# EAGLE design nodo_PS (EAGLE 9.6.2)
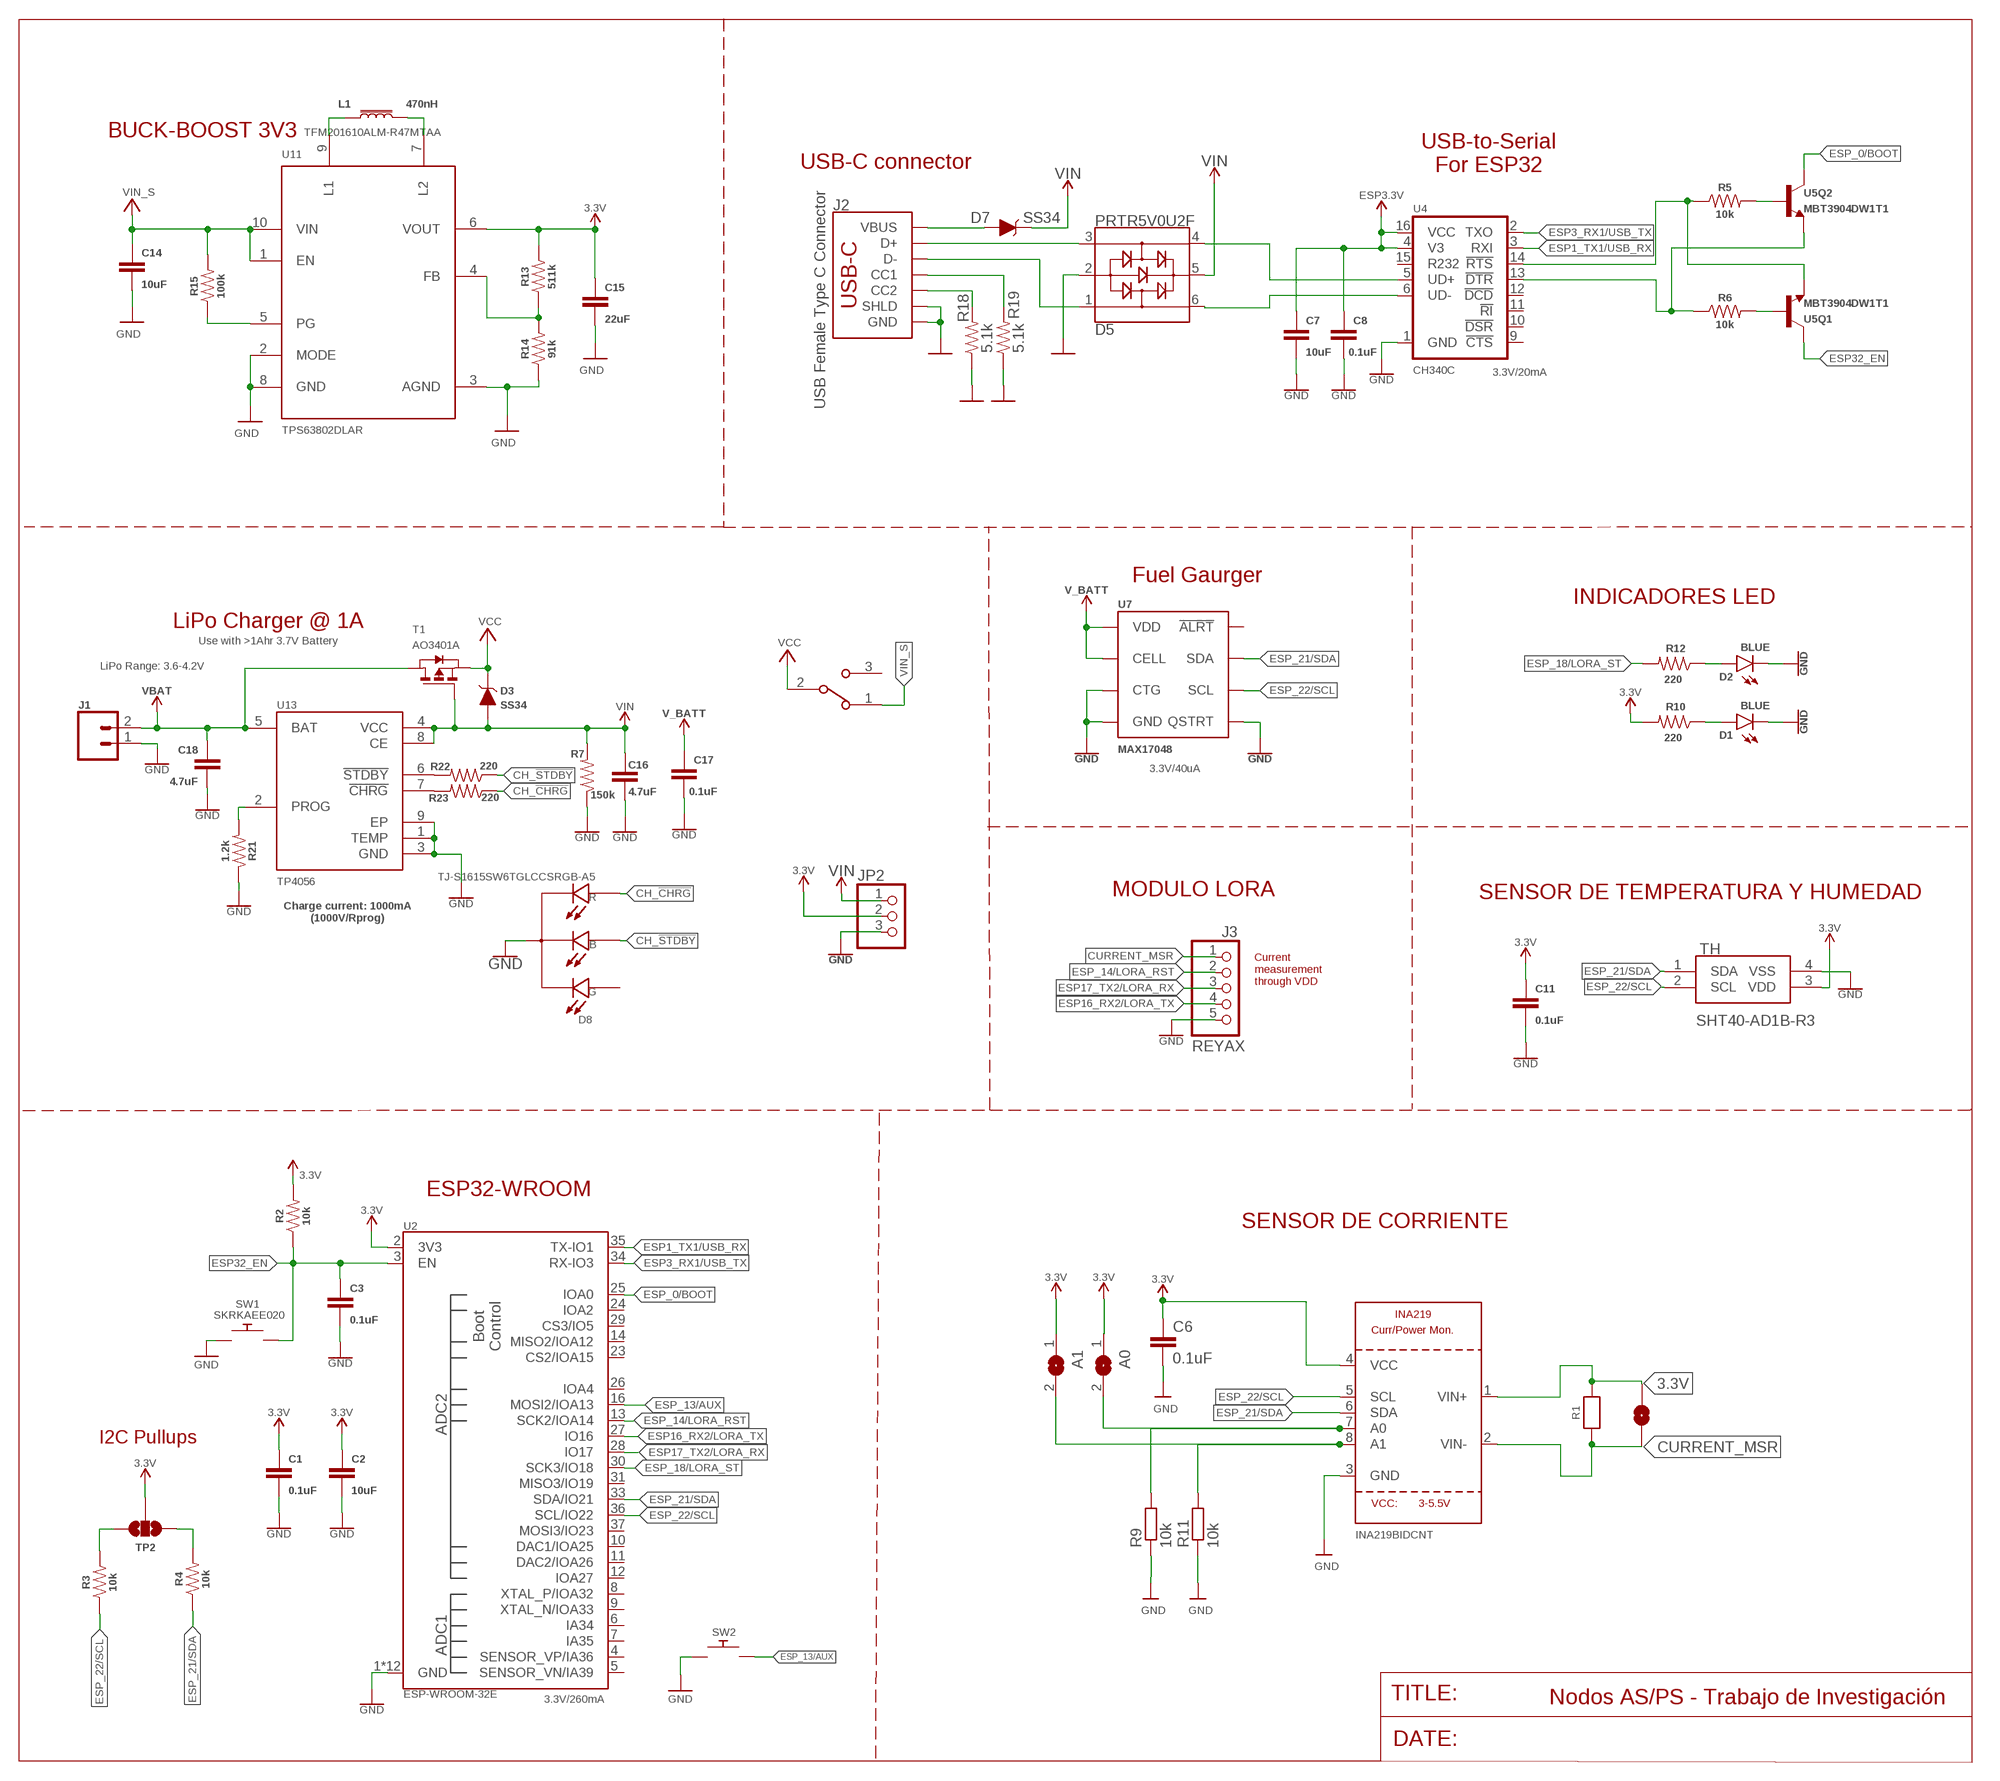
[diagram p0: schematic, sheet 1]

## Parts
A0  SOLDERJUMPERREFLOW_NOPASTE  [SOLDERJUMPER_REFLOW_NOPASTE]
A1  SOLDERJUMPERREFLOW_NOPASTE  [SOLDERJUMPER_REFLOW_NOPASTE]
C1  0.1uF  0.1UF-0603-25V-(+80/-20%)  [0603]
C2  10uF  10UF-0603-6.3V-20%  [0603]
C3  0.1uF  0.1UF-0603-25V-(+80/-20%)  [0603]
C6  0.1uF  C-EUC0805  [C0805]
C7  10uF  10UF-0603-6.3V-20%  [0603]
C8  0.1uF  0.1UF-0603-25V-(+80/-20%)  [0603]
C11  0.1uF  0.1UF-0603-25V-(+80/-20%)  [0603]
C14  10uF  22UF-1206-50V-10%  [1206]
C15  22uF  22UF-1206-50V-10%  [1206]
C16  4.7uF  4.7UF-0603-35V-(20%)  [0603]
C17  0.1uF  0.1UF-0603-25V-(+80/-20%)  [0603]
C18  4.7uF  4.7UF-0603-35V-(20%)  [0603]
D1  BLUE  LED-YELLOW0603  [LED-0603]
D2  BLUE  LED-YELLOW0603  [LED-0603]
D3  SS34  DIODE_TVS_UNI  [DO-214AC]
D5  PRTR5V0U2F  [SOT886]
D7  SS34  DIODE_TVS_UNI  [DO-214AC]
D8  TJ-S1615SW6TGLCCSRGB-A5  OSTB0603C1C  [LED_OSTB0603C1C]
J1  CONN_02LOCK_LONGPADS  [1X02_LOCK_LONGPADS]
J2  USB Female Type C Connector  USB_C_4-LAYER_PADS  [USB-C-16P_4LAYER-PADS]
J3  REYAX  PINHD-1X5  [1X05]
JP1  JUMPER-SMT_2_NO_NO-SILK_ROUND  [SMT-JUMPER_2_NO_NO-SILK_ROUND]
JP2  PINHD-1X3  [1X03]
L1  470nH  FERRITE_BEAD-0805-600Ω-100MHZ  [0805]
R1  0.1/1% (PT2512FK-070R1L)  RESISTOR2512  [2512]
R2  10k  10KOHM-0603-1/10W-1%  [0603]
R3  10k  10KOHM-0603-1/10W-1%  [0603]
R4  10k  10KOHM-0603-1/10W-1%  [0603]
R5  10k  10KOHM-0603-1/10W-1%  [0603]
R6  10k  10KOHM-0603-1/10W-1%  [0603]
R7  150k  150KOHM-0603-1/10W-1%  [0603]
R9  10k  R-EU_R0805  [R0805]
R10  220  20OHM-0603-1/10W-1%  [0603]
R11  10k  R-EU_R0805  [R0805]
R12  220  20OHM-0603-1/10W-1%  [0603]
R13  511k  750KOHM-0603-1/10W-1%  [0603]
R14  91k  750KOHM-0603-1/10W-1%  [0603]
R15  100k  750KOHM-0603-1/10W-1%  [0603]
R18  5.1k  5.1KOHM5.1KOHM-0603-1/10W-1%  [0603]
R19  5.1k  5.1KOHM5.1KOHM-0603-1/10W-1%  [0603]
R21  1.2k  150KOHM-0603-1/10W-1%  [0603]
R22  220  20OHM-0603-1/10W-1%  [0603]
R23  220  20OHM-0603-1/10W-1%  [0603]
S1  EG1213  [SW_EG1213]
SENSORCORRIENTE  INA219BIDCNT  INA219  [SOT23-8]
SW1  SKRKAEE020  [SKRKAEE020]
SW2  SKRKAEE020  [SKRKAEE020]
T1  AO3401A  PMOSSOT23  [SOT-23]
TH  SHT40-AD1B-R3  [SHT40AD1BR3]
TP2  JUMPER-SMT_3_NO_NO-SILK  [SMT-JUMPER_3_NO_NO-SILK]
U2  ESP-WROOM-32E  ESP-WROOM-3232D-NARROW  [ESP-WROOM-32D-NARROW]
U4  CH340C  [SO016]
U5  MBT3904DW1T1  TRANS_NPN_DUAL-MBT3904DW1T1  [SC70-6]
U7  MAX17048  MAX17048DFN8  [DFN-8]
U11  TPS63802DLAR  [VREG_TPS63802DLAR]
U13  TP4056  [SOP127P600X175-9N]

## Nets
3.3V [power]: A0.1 A1.1 C1.1 C2.1 C6.1 C7.1 C8.1 C11.1 C15.1 JP1.1 JP2.2 R1.2 R2.2 R10.2 R13.2 SENSORCORRIENTE.1(VIN+) SENSORCORRIENTE.4(VCC) TH.3(VDD) TP2.2 U2.2(3V3) U4.4(V3) U4.16(VCC) U11.6(VOUT) ; supply symbol labelled ESP3.3V
ADDR0: A0.2 R9.2 SENSORCORRIENTE.7(A0)
ADDR1: A1.2 R11.2 SENSORCORRIENTE.8(A1)
CC1: J2.B5(CC2) R18.2
CC2: J2.A5(CC1) R19.2
CH_!CHRG: D8.3 R23.1
CH_!STDBY: D8.2 R22.1
CURRENT_MSR: J3.1 JP1.2 R1.1 SENSORCORRIENTE.2(VIN-)
ESP1_TX1/USB_RX: U2.35(TX-IO1) U4.3(RXI)
ESP3_RX1/USB_TX: U2.34(RX-IO3) U4.2(TXO)
ESP16_RX2/LORA_TX: J3.4 U2.27(IO16)
ESP17_TX2/LORA_RX: J3.3 U2.28(IO17)
ESP32_!DTR: R6.1 U4.13(!DTR) U5.1(Q2:E)
ESP32_!RTS: R5.1 U4.14(!RTS) U5.4(Q1:E)
ESP32_EN: C3.1 R2.1 SW1.2 U2.3(EN) U5.3(Q1:C)
ESP_0/BOOT: U2.25(IOA0) U5.6(Q2:C)
ESP_13/AUX: SW2.2 U2.16(MOSI2/IOA13)
ESP_14/LORA_RST: J3.2 U2.13(SCK2/IOA14)
ESP_18/LORA_ST: R12.2 U2.30(SCK3/IO18)
ESP_21/SDA: R4.1 SENSORCORRIENTE.6(SDA) TH.1(SDA) U2.33(SDA/IO21) U7.8(SDA)
ESP_22/SCL: R3.1 SENSORCORRIENTE.5(SCL) TH.2(SCL) U2.36(SCL/IO22) U7.7(SCL)
GND: C1.2 C2.2 C3.2 C6.2 C7.2 C8.2 C11.2 C14.2 C15.2 C16.2 C17.2 C18.2 D1.C D2.C D5.2 D8.4 J1.1 J2.GND J2.GND2(GND) J2.SHLD2(SHLD) J2.SHLD3(SHLD) J2.SHLD4(SHLD) J2.SHLD5(SHLD) J3.5 JP2.3 R7.1 R9.1 R11.1 R14.1 R18.1 R19.1 R21.1 SENSORCORRIENTE.3(GND) SW1.1 SW2.1 TH.4(VSS) U2.1(GND) U2.15(GND) U2.38(GND) U2.GND1(GND) U2.GNDT1(GND) U2.GNDT2(GND) U2.GNDT3(GND) U2.GNDT4(GND) U2.GNDT5(GND) U2.GNDT6(GND) U2.GNDT7(GND) U2.GNDT8(GND) U4.1(GND) U7.1(CTG) U7.4(GND) U7.6(QSTRT) U7.9(GND) U11.2(MODE) U11.3(AGND) U11.8(GND) U13.1(TEMP) U13.3(GND) U13.9(EP)
N$1: D5.1 J2.A7(D-) J2.B7(D-)
N$3: D5.4 U4.5(UD+)
N$4: D5.6 U4.6(UD-)
N$5: D1.A R10.1
N$7: D2.A R12.1
N$8: L1.1 U11.9(L1)
N$10: L1.2 U11.7(L2)
N$11: R22.2 U13.6(!STDBY)
N$12: R13.1 R14.2 U11.4(FB)
N$13: R23.2 U13.7(!CHRG)
N$14: R3.2 TP2.3
N$15: R4.2 TP2.1
N$18: R15.1 U11.5(PG)
N$24: R6.2 U5.5(Q1:B)
N$25: R5.2 U5.2(Q2:B)
N$31: R21.2 U13.2(PROG)
USB-C-D+: D5.3 J2.A6(D+) J2.B6(D+)
VBAT [power]: C17.1 C18.1 J1.2 T1.1(D) U7.2(CELL) U7.3(VDD) U13.5(BAT) ; supply symbol labelled V_BATT
VBUS [power]: D7.A J2.VBUS1(VBUS) J2.VBUS2(VBUS)
VCC: D3.C S1.2 T1.2(S)
VIN: C16.1 D3.A D5.5 D7.C JP2.1 R7.2 T1.3(G) U13.4(VCC) U13.8(CE)
VIN_S [power]: C14.1 R15.2 S1.1 U11.1(EN) U11.10(VIN)
Unconnected: D8.1 S1.3 U2.4(SENSOR_VP/IA36) U2.5(SENSOR_VN/IA39) U2.6(IA34) U2.7(IA35) U2.8(XTAL_P/IOA32) U2.9(XTAL_N/IOA33) U2.10(DAC1/IOA25) U2.11(DAC2/IOA26) U2.12(IOA27) U2.14(MISO2/IOA12) U2.23(CS2/IOA15) U2.24(IOA2) U2.26(IOA4) U2.29(CS3/IO5) U2.31(MISO3/IO19) U2.37(MOSI3/IO23) U4.9(!CTS) U4.10(!DSR) U4.11(!RI) U4.12(!DCD) U4.15(R232) U7.5(!ALRT)

## Notes on the sheet
- BUCK-BOOST 3V3
- TFM201610ALM-R47MTAA
- USB-to-Serial
  For ESP32
- USB-C connector
- 3.3V/20mA
- Fuel Gaurger
- INDICADORES LED
- LiPo Charger @ 1A
- Use with >1Ahr 3.7V Battery
- LiPo Range: 3.6-4.2V
- 3.3V/40uA
- MODULO LORA | SENSOR DE TEMPERATURA Y HUMEDAD
- Charge current: 1000mA
  (1000V/Rprog)
- Current
  measurement
  through VDD
- ESP32-WROOM
- SENSOR DE CORRIENTE
- I2C Pullups
- 3.3V/260mA | TITLE: | Nodos AS/PS - Trabajo de Investigación
- DATE:

## Library data of the parts
A0 A1 = microbuilder:SOLDERJUMPER: SMD Solder JUMPER Solder the two pads together to create a connection, or remove the solder to break it. REFLOW - Use this footprint for solder paste and reflow ovens. WAVE - Use this footprint for hand-soldering (larger pads). CLOSED - Has a trace between the two pads to ensure it is closed by default. The trace needs to be cut to disable the jumper, and can be closed again by creating a solder bridge between the two pads.
C1 C3 C8 C11 C17 = SparkFun-Capacitors:0.1UF: 0.1µF ceramic capacitors A capacitor is a passive two-terminal electrical component used to store electrical energy temporarily in an electric field.; PROD_ID: CAP-00810
C2 C7 = SparkFun-Capacitors:10UF: 10.0µF ceramic capacitors A capacitor is a passive two-terminal electrical component used to store electrical energy temporarily in an electric field.; PROD_ID: CAP-11015
C6 = rcl:C-EU: CAPACITOR, European symbol; SPICEPREFIX: C
C14 = SparkFun-Capacitors:22UF: 22µF ceramic capacitors A capacitor is a passive two-terminal electrical component used to store electrical energy temporarily in an electric field.; PROD_ID: CAP-15263; VALUE: 22uF
C15 = SparkFun-Capacitors:22UF: 22µF ceramic capacitors A capacitor is a passive two-terminal electrical component used to store electrical energy temporarily in an electric field.; PROD_ID: CAP-15263
C16 C18 = SparkFun-Capacitors:4.7UF: 4.7µF ceramic capacitors A capacitor is a passive two-terminal electrical component used to store electrical energy temporarily in an electric field.; PROD_ID: CAP-14106
D1 D2 = SparkFun-LED:LED-YELLOW: Yellow SMD LED Used in manufacturing several products at SparkFun. Packages: 0603 - SMD 0603 package[Product Link] <http://www.kingbrightusa.com/product.asp?catalog_name=LED&product_id=APT1608SYCK> 0603 -SMART - SMART SMD 0603 package (more efficient/more expensive) [Product Link] <http://www.osram-os.com/osram_os/en/products/product-catalog/led-light-emitting-diodes/smartled-0603/ly-l29k/index.jsp> LilyPad - SMD1206 package[Product Datasheet] <https://www.sparkfun.com/datasheets/DevTools/LilyPad/Q150YUS4.pdf> SparkFun Products: Blynk Board <https://www.sparkfun.com/products/13794> IOIO-OTG <https://www.sparkfun.com/products/13613> XBee Explorer Serial <https://www.sparkfun.com/products/13225>; PROD_ID: DIO-09003; VALUE: Yellow
D3 D7 = SparkFun-DiscreteSemi:DIODE_TVS_UNI; PROD_ID: DIO-15812; VALUE: SMAJ36A
D5 = SparkFun-IC-Power:PRTR5V0U2: A small ESD protection device. Most commonly used on USB D+/D- signals to protect large, expensive, or especially sensitive USB enabled devices.; PROD_ID: DIO-14084
D8 = SMD_RGB_:OSTB0603C1C: LED; SMD; 0603; RGB; 1.6x1.5mm; 120°; Variant: tricolou Check availability <https://pricing.snapeda.com/parts/OSTB0603C1C/OptoSupply/view-part?ref=eda>; AVAILABILITY: Not in stock; DESCRIPTION: LED; SMD; 0603; RGB; 1.6x1.5mm; 120°; Variant: tricolou; MF: OptoSupply; MP: OSTB0603C1C; PACKAGE: 0603 OptoSupply; PRICE: None
J1 = SparkFun-Connectors:CONN_02: Multi connection point. Often used as Generic Header-pin footprint for 0.1 inch spaced/style header connections On any of the 0.1 inch spaced packages, you can populate with these: Break Away Headers - Straight <https://www.sparkfun.com/products/116> (PRT-00116) Break Away Male Headers - Right Angle <https://www.sparkfun.com/products/553> (PRT-00553) Female Headers <https://www.sparkfun.com/products/115> (PRT-00115) Break Away Headers - Machine Pin <https://www.sparkfun.com/products/117> (PRT-00117) Break Away Female Headers - Swiss Machine Pin <https://www.sparkfun.com/products/743> (PRT-00743) For SCREWTERMINALS and SPRING TERMINALS visit here: Screw Terimnals on SparkFun.com <https://www.sparkfun.com/search/results?term=Screw+Terminals> (5mm/3.5mm/2.54mm spacing) This device is also useful as a general connection point to wire up your design to another part of your project. Our various solder wires solder well into these plated through hole pads. Hook-Up Wire - Assortment (Stranded, 22 AWG) <https://www.sparkfun.com/products/11375> (PRT-11375) Hook-Up Wire - Assortment (Solid Core, 22 AWG) <https://www.sparkfun.com/products/11367> (PRT-11367) View the entire wire category on our website here <https://www.sparkfun.com/categories/141> Special notes: Molex polarized connector foot print use with: PRT-08233 with associated crimp pins and housings. 2.54_SCREWTERM for use with PRT-10571. 3.5mm Screw Terminal footprints for PRT-08084 5mm Screw Terminal footprints for use with PRT-08432
J2 = SparkFun-Connectors:USB_C: USB Type C 16Pin Connector Super Speed pins not available on the 16-pin purely SMD connector so this part is best for USB 2.0 implementations. D1 and D2 are tied together enabling D+/- no matter which way the cable is plugged into the connector. The two channel configuration pins (CC1/2) are exposed. These are normally connected to ground via 5.1k resistors but can be reconfigured for high current/high power applications. **4-LAYER BOARD WARNING!!** If designing 4-layer board, make sure to select the variant _4-LAYER-ISOLATED. The linked footprint (USB-C-16-4LAYER-ISOLATED) includes some very necessary cutout polygons in the inner layers (2 and 15). This prevents the PTH mounting shield legs on the USB connector from electrically connecting any other polygons on the inner layers (usually VCC and GND).; PROD_ID: CONN-14122
J3 = pinhead:PINHD-1X5: PIN HEADER
JP1 = SparkFun-Jumpers:JUMPER-SMT_2_NO: Normally open jumper This jumper has two pads in close proximity to each other. Apply solder to close the connection. Round pads are easier to solder for beginners, but are a lot larger. SparkFun Product that uses the round pads: SparkFun EL Sequencer <https://www.sparkfun.com/products/12781>
JP2 = pinhead:PINHD-1X3: PIN HEADER
L1 = SparkFun-Coils:FERRITE_BEAD: Ferrite Bead (blocks, cores, rings, chokes, etc.) Inductor with layers of ferrite used to suppress high frequencies. Often used to isolate high frequency noise. SparkFun Products: IOIO-OTG - V2.2 <https://www.sparkfun.com/products/13613> SparkFun SAMD21 Mini Breakout <https://www.sparkfun.com/products/13664> SparkFun 6 Degrees of Freedom Breakout - LSM6DS3 <https://www.sparkfun.com/products/13339> SparkFun SAMD21 Dev Breakout <https://www.sparkfun.com/products/13672>; PROD_ID: NDUC-14988; VALUE: 600Ω
R1 = microbuilder:RESISTOR: Resistors For new designs, use the packages preceded by an '_' character since they are more reliable: The following footprints should be used on most boards: _0402 - Standard footprint for regular board layouts _0603 - Standard footprint for regular board layouts _0805 - Standard footprint for regular board layouts _1206 - Standard footprint for regular board layouts For extremely tight-pitch boards where space is at a premium, the following 'micro-pitch' footprints can be used (smaller pads, no silkscreen outline, etc.): _0402MP - Micro-pitch footprint for very dense/compact boards _0603MP - Micro-pitch footprint for very dense/compact boards _0805MP - Micro-pitch footprint for very dense/compact boards _1206MP - Micro-pitch footprint for very dense/compact boards
R2-R6 = SparkFun-Resistors:10KOHM: 10kΩ resistor A resistor is a passive two-terminal electrical component that implements electrical resistance as a circuit element. Resistors act to reduce current flow, and, at the same time, act to lower voltage levels within circuits. - Wikipedia; PROD_ID: RES-00824
R7 = SparkFun-Resistors:150KOHM: 150kΩ resistor A resistor is a passive two-terminal electrical component that implements electrical resistance as a circuit element. Resistors act to reduce current flow, and, at the same time, act to lower voltage levels within circuits. - Wikipedia; PROD_ID: RES-09117
R9 R11 = rcl:R-EU_: RESISTOR, European symbol; SPICEPREFIX: R
R10 R12 R22 R23 = SparkFun-Resistors:20OHM: RES-07862; PROD_ID: RES-07862; VALUE: 20
R13-R15 = SparkFun-Resistors:750KOHM: 750Ω resistor A resistor is a passive two-terminal electrical component that implements electrical resistance as a circuit element. Resistors act to reduce current flow, and, at the same time, act to lower voltage levels within circuits. - Wikipedia; PROD_ID: RES-13768; VALUE: 750K
R18 R19 = SparkFun-Resistors:5.1KOHM; PROD_ID: RES-12083
R21 = SparkFun-Resistors:150KOHM: 150kΩ resistor A resistor is a passive two-terminal electrical component that implements electrical resistance as a circuit element. Resistors act to reduce current flow, and, at the same time, act to lower voltage levels within circuits. - Wikipedia; PROD_ID: RES-09117; VALUE: 150k
S1 = EG1213:EG1213: EG Series SPDT On-On Right Angle Through Hole Slide Switch Check prices <https://pricing.snapeda.com/parts/EG1213/E-Switch/view-part?ref=eda>; AVAILABILITY: In Stock; DESCRIPTION: Slide Switch SPDT Through Hole, Right Angle; MF: E-Switch; MP: EG1213; PACKAGE: None; PRICE: None; PURCHASE-URL: https://pricing.snapeda.com/search/part/EG1213/?ref=eda
SENSORCORRIENTE = microbuilder:INA219: INA219 - I2C Current/Power Monitor Voltage Range: 0-26V Accuracy: 0.5% Temperature: -40°C - 125°C
SW1 SW2 = SKRKAEE020:SKRKAEE020: Tactile Switches 3.9x2.9x2.0mm 160gf Packaging Temp 80oC Source: Datasheet <http://www.alps.com/prod/info/J/HTML/Tact/SurfaceMount/SKRK/SKRKAEE020.html>; DESCRIPTION: Tactile Switches 3.9x2.9x2.0mm 160gf Packaging Temp 80oC; HEIGHT: 2mm; MANUFACTURER_NAME: ALPS Electric; MANUFACTURER_PART_NUMBER: SKRKAEE020; MOUSER_PART_NUMBER: 688-SKRKAEE020; MOUSER_PRICE-STOCK: https://www.mouser.co.uk/ProductDetail/Alps-Alpine/SKRKAEE020?qs=MrosSN5%252BUQW89XjXIp8Ugw%3D%3D
T1 = zetex:PMOSSOT23: MOS FET; OC_FARNELL: unknown; OC_NEWARK: unknown
TH = SHT40-AD1B-R3:SHT40-AD1B-R3: Humidity/Temperature Sensor Digital Serial (I2C) T/R Source: Datasheet <https://www.arrow.com/en/products/sht40-ad1b-r3/sensirion-ag>; DESCRIPTION: Humidity/Temperature Sensor Digital Serial (I2C) T/R; HEIGHT: 0.59mm; MANUFACTURER_NAME: Sensirion; MANUFACTURER_PART_NUMBER: SHT40-AD1B-R3; MOUSER_PART_NUMBER: 403-SHT40-AD1B-R3; MOUSER_PRICE-STOCK: https://www.mouser.co.uk/ProductDetail/Sensirion/SHT40-AD1B-R3?qs=zW32dvEIR3sa7U6cFW6pBw%3D%3D
TP2 = SparkFun-Jumpers:JUMPER-SMT_3_NO: Normally open jumper This jumper has three pads in close proximity to each other. Apply solder to close the connection(s).
U2 = SparkFun-RF:ESP-WROOM-32: ESP-WROOM-32D - trace antenna (includes keepout) ESP-WROOM-32U - U.FL antenna connector Includes both "standard" footprints and "narrow" version (for use with tighter layouts).; PROD_ID: IC-15676
U4 = SparkFun-IC-Comms:CH340C; PROD_ID: IC-14038
U5 = SparkFun-DiscreteSemi:TRANS_NPN_DUAL: Dual NPN Transistors in Single Package The MBT3904W1 puts two general purpose 3904 NPN transistors in a single package. Datasheet <http://www.onsemi.com/pub_link/Collateral/MBT3904DW1T1-D.PDF> SparkFun Products: SparkFun ESP32 Thing <https://www.sparkfun.com/products/13907>; PROD_ID: TRANS-13337
U7 = SparkFun-IC-Power:MAX17048: Micropower 1-Cell Li+ ModelGauge SparkFun Products Qduino Mini <https://www.sparkfun.com/products/13614> (DEV-13614); PROD_ID: IC-12551
U11 = TPS63802DLAR:TPS63802DLAR: Buck-Boost Switching Regulator IC Positive Adjustable 1.8V 1 Output 2A 10-VFDFN Check availability <https://pricing.snapeda.com/parts/TPS63802DLAR/Texas%20Instruments/view-part?ref=eda>; AVAILABILITY: In Stock; DESCRIPTION: 2-A, high-efficient, 11-µA quiescent current buck-boost converter in QFN/DFN package; MF: Texas Instruments; MP: TPS63802DLAR; PACKAGE: VSON-HR-10 Texas Instruments; PRICE: None; PURCHASE-URL: https://pricing.snapeda.com/search/part/TPS63802DLAR/?ref=eda
U13 = TP4056:TP4056: Complete single cell Li-Ion battery with a constant current / constant voltage linear charger Check availability <https://pricing.snapeda.com/parts/TP4056/NanJing%20Top%20Power%20ASIC%20Corp./view-part?ref=eda>; AVAILABILITY: Not in stock; DESCRIPTION: Complete single cell Li-Ion battery with a constant current / constant voltage linear charger; MF: NanJing Top Power ASIC Corp.; MP: TP4056; PACKAGE: None; PRICE: None

## Net classes
1 power: width 0.305 mm

## Board
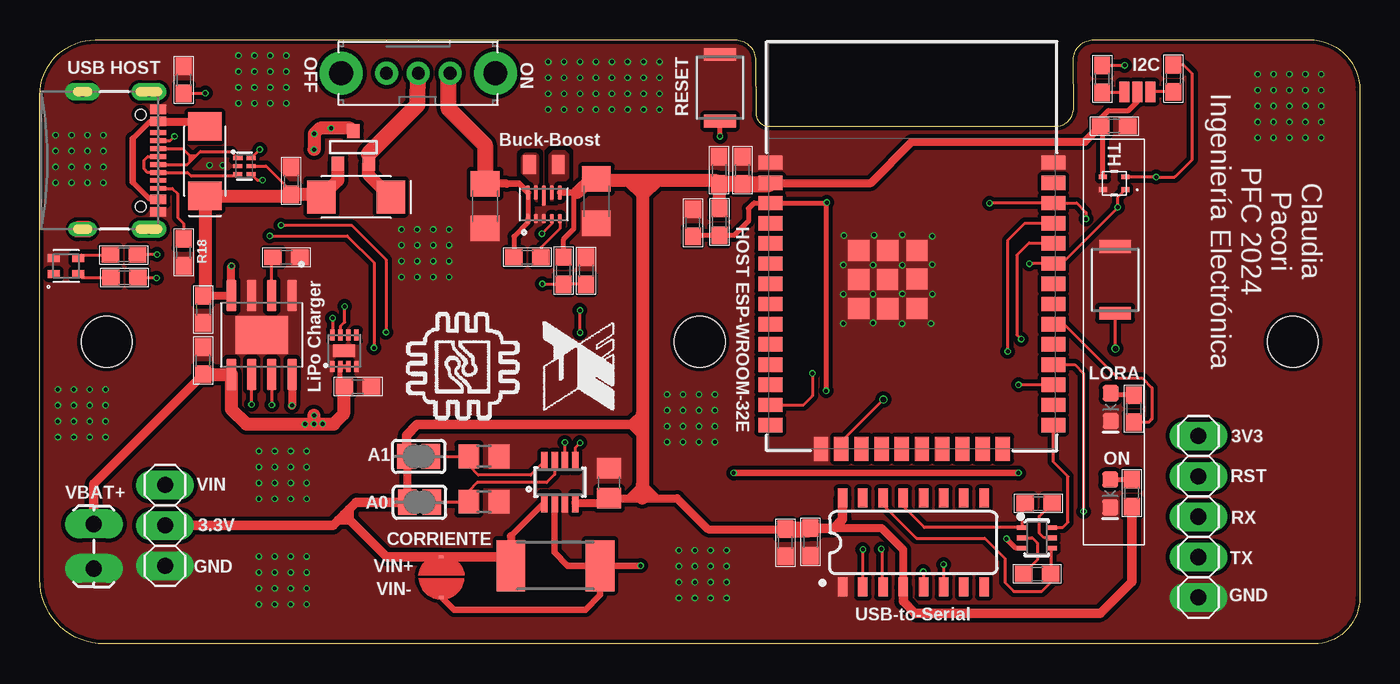
[diagram p1: board, top side]
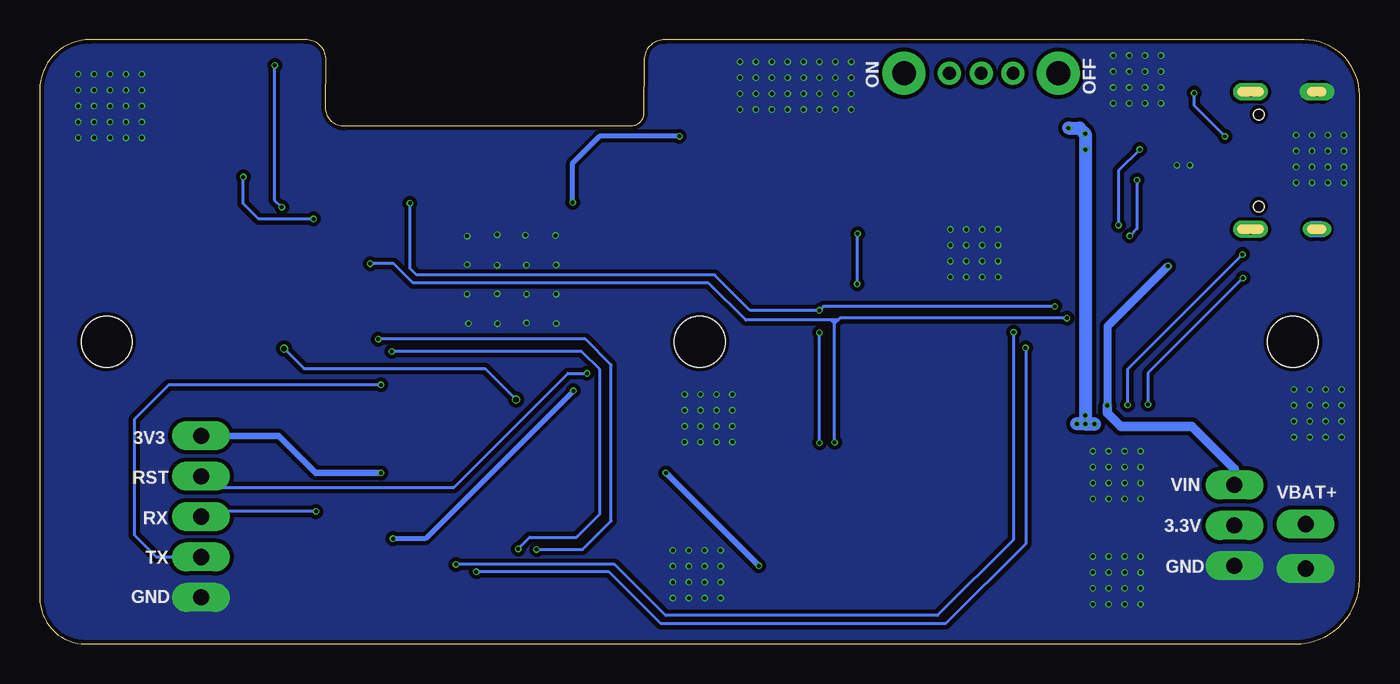
[diagram p2: board, bottom side, seen from below]

Size 83 x 38 mm. Coordinates in mm from the lower left corner, seen from the top.
Outline: 83,34.86 83,2.88 arc-90 80.12,0 4.04,0 arc-90 0,4.04 0,34.5 arc-90 3.5,38 43.71,38 arc-90 45,36.71 45.02,33.41 arc90 45.88,32.55 63.84,32.55 arc90 65.02,33.73 65,36.73 arc-90 66.27,38 79.86,38 arc-90 83,34.86
Copper layers (1*16): Top 0.035mm / dielectric 1.6mm / Bottom 0.035mm
Design rules "jlcpcb-2layers_my": minimum track width 5mil, minimum drill 0.2mm, track to track 5mil, track to pad 5mil, pad to pad 5mil, via to via 5mil, smd to smd 5mil, copper to edge 0.2mm, drill to drill 10mil, minimum pad ring 10mil, minimum via ring 3mil, stop-mask expansion 4mil, vias tented up to drill 0.2mm, thermal gap 10mil
Holes 3.17 mm at 41.5,19 78.8,19 4.2,19

### Footprints (pad centres in the part's own frame; a part is rotated, then mirrored left to right if it is on the bottom)
SOLDERJUMPER_REFLOW_NOPASTE = smd 1.168 x 1.6: 1 -0.762,0; 2 0.762,0
0603 = smd 1.1 x 1: 1 -0.85,0; 2 0.85,0
C0805 = smd 1.3 x 1.5: 1 -0.95,0; 2 0.95,0
1206 = smd 1.6 x 1.8: 1 -1.4,0; 2 1.4,0
LED-0603 = smd 1 x 1: A -0.877,0; C 0.877,0
DO-214AC = smd 1.778 x 2.083: A 2.21,0; C -2.159,0
SOT886 = smd 0.61 x 0.25: 1 -0.405,0.5 | smd 0.56 x 0.25: 2 -0.43,0; 3 -0.43,-0.5; 4 0.43,-0.5; 5 0.43,0; 6 0.43,0.5
LED_OSTB0603C1C = smd 0.5 x 0.75: 1 -0.5,0.775; 2 -0.5,-0.775; 3 0.5,-0.775; 4 0.5,0.775
1X02_LOCK_LONGPADS = drill 1.016 long: 1 -0.127,0; 2 2.667,0
USB-C-16P_4LAYER-PADS = smd 0.3 x 1: A5 -1.25,-0.34; A6 -0.25,-0.34; A7 0.25,-0.34; A8 1.25,-0.34; B5 1.75,-0.34; B6 0.75,-0.34; B7 -0.75,-0.34; B8 -1.75,-0.34 | smd 0.6 x 1: GND -3.225,-0.34; GND2 3.225,-0.34; VBUS1 -2.45,-0.34; VBUS2 2.45,-0.34 | drill 0.6 pad 1.016 long: SHLD2 4.318,-0.915; SHLD5 -4.318,-0.915 | drill 0.6 pad 0.813 long: SHLD3 -4.318,-5.095 | drill 0.4 pad 0.813 long: SHLD4 4.318,-5.095 | hole 0.65: -2.89,-1.445; 2.89,-1.445
1X05 = drill 1.016 long: 1 -5.08,0; 2 -2.54,0; 3 0,0; 4 2.54,0; 5 5.08,0
SMT-JUMPER_2_NO_NO-SILK_ROUND = smd 0.152 x 0.305: 1 -1.27,0; 2 1.27,0
1X03 = drill 1.016 long: 1 -2.54,0; 2 0,0; 3 2.54,0
0805 = smd 0.8 x 1.2: 1 -0.9,0; 2 0.9,0
2512 = smd 1.8 x 3.2: 1 -2.8,0; 2 2.8,0
R0805 = smd 1.3 x 1.5: 1 -0.95,0; 2 0.95,0
SW_EG1213 = drill 0.8: 1 -2,0; 2 0,0; 3 2,0 | drill 1.5: P$4 -4.85,0; P$5 4.85,0
SOT23-8 = smd 0.4 x 1.2: 1 -0.975,-1.3; 2 -0.325,-1.3; 3 0.325,-1.3; 4 0.975,-1.3; 5 0.975,1.3; 6 0.325,1.3; 7 -0.325,1.3; 8 -0.975,1.3
SKRKAEE020 = smd 0.8 x 2: 1 -2.1,0; 2 2.1,0
SOT-23 = smd 0.787 x 0.889: 1 0.025,-1.016; 2 -0.94,1.016; 3 0.991,1.016
SHT40AD1BR3 = smd 0.5 x 0.3: 1 -0.7,0.4; 2 -0.7,-0.4; 3 0.7,-0.4; 4 0.7,0.4
SMT-JUMPER_3_NO_NO-SILK = smd 0.635 x 1.27: 1 -0.813,0; 2 0,0; 3 0.813,0
ESP-WROOM-32D-NARROW = smd 0.9 x 1.5: 1 6.43,8.898; 2 5.16,8.898; 3 3.89,8.898; 4 2.62,8.898; 5 1.35,8.898; 6 0.08,8.898; 7 -1.19,8.898; 8 -2.46,8.898; 9 -3.73,8.898; 10 -5,8.898; 11 -6.27,8.898; 12 -7.54,8.898; 13 -8.81,8.898; 14 -10.08,8.898; 25 -10.08,-8.898; 26 -8.81,-8.898; 27 -7.54,-8.898; 28 -6.27,-8.898; 29 -5,-8.898; 30 -3.73,-8.898; 31 -2.46,-8.898; 32 -1.19,-8.898; 33 0.08,-8.898; 34 1.35,-8.898; 35 2.62,-8.898; 36 3.89,-8.898; 37 5.16,-8.898; 38 6.43,-8.898 | smd 1.5 x 0.9: 15 -11.57,5.715; 16 -11.57,4.445; 17 -11.57,3.175; 18 -11.57,1.905; 19 -11.57,0.635; 20 -11.57,-0.635; 21 -11.57,-1.905; 22 -11.57,-3.175; 23 -11.57,-4.445; 24 -11.57,-5.715 | smd 1.33 x 1.33: GND1 -0.912,1.531; GNDT1 -2.751,3.346; GNDT2 -2.761,1.516; GNDT3 -2.751,-0.314; GNDT4 -0.891,-0.324; GNDT5 0.909,-0.314; GNDT6 0.909,1.516; GNDT7 0.909,3.346; GNDT8 -0.921,3.346
SO016 = smd 0.6 x 1.2: 1 -4.445,-2.8; 2 -3.175,-2.8; 3 -1.905,-2.8; 4 -0.635,-2.8; 5 0.635,-2.8; 6 1.905,-2.8; 7 3.175,-2.8; 8 4.445,-2.8; 9 4.445,2.8; 10 3.175,2.8; 11 1.905,2.8; 12 0.635,2.8; 13 -0.635,2.8; 14 -1.905,2.8; 15 -3.175,2.8; 16 -4.445,2.8
SC70-6 = smd 0.3 x 0.66: 1 -0.65,-0.92; 2 0,-0.92; 3 0.65,-0.92; 4 0.65,0.92; 5 0,0.92; 6 -0.65,0.92
DFN-8 = smd 0.3 x 0.7: 1 -0.75,-0.99; 2 -0.25,-0.99; 3 0.25,-0.99; 4 0.75,-0.99; 5 0.75,0.99; 6 0.25,0.99; 7 -0.25,0.99; 8 -0.75,0.99 | smd 1.38 x 0.8: 9 0,0
VREG_TPS63802DLAR = smd 0.6 x 0.25: 1 -0.9,1; 2 -0.9,0.5; 3 -0.9,0; 4 -0.9,-0.5; 5 -0.9,-1 | smd 0.9 x 0.25: 6 0.75,-1; 7 0.75,-0.5; 9 0.75,0.5; 10 0.75,1 | smd 1.3 x 0.25: 8 0.55,0
SOP127P600X175-9N = smd 1.97 x 0.6: 1 -2.475,1.905; 2 -2.475,0.635; 3 -2.475,-0.635; 4 -2.475,-1.905; 5 2.475,-1.905; 6 2.475,-0.635; 7 2.475,0.635; 8 2.475,1.905 | smd 2.413 x 3.302: 9 0,0

### Placement (x,y rotation side)
A0  23.88,8.91 0 top
A1  23.83,11.79 0 top
C1  44.18,29.78 90 top
C2  42.72,29.79 90 top
C3  41.07,26.47 90 top
C6  35.8,10.11 90 top
C7  48.46,6.42 270 top
C8  46.88,6.37 270 top
C11  67.55,32.56 0 top
C14  28,27.54 270 top
C15  35,27.84 270 top
C16  10.28,21.05 270 top
C17  19.99,16.18 0 top
C18  10.28,17.8 90 top
D1  67.31,9.46 270 top
D2  67.34,14.89 270 top
D3  19.91,28.11 180 top
D5  12.87,30.05 0 top
D7  10.39,30.34 90 top
D8  1.65,23.76 90 top
J1  3.4,4.87 90 top
J2  7.79,30.4 270 top
J3  72.86,8 270 top
JP1  25.26,4.2 270 top
JP2  7.88,7.45 270 top
L1  31.7,30.14 0 top
R1  32.43,4.92 180 top
R2  42.73,26.54 90 top
R3  71.27,35.55 270 top
R4  66.8,35.54 270 top
R5  62.72,4.41 180 top
R6  62.8,8.83 0 top
R7  15.81,29.13 270 top
R9  27.93,8.95 180 top
R10  68.66,9.47 270 top
R11  27.93,11.8 180 top
R12  68.79,14.79 270 top
R13  32.94,23.48 90 top
R14  34.35,23.47 270 top
R15  30.66,24.33 180 top
R18  9.04,24.63 90 top
R19  9.06,35.48 270 top
R21  15.51,24.31 180 top
R22  5.33,23.03 0 top
R23  5.28,24.47 0 top
S1  23.8,35.89 180 top
SENSORCORRIENTE  32.7,10.17 0 top
SW1  42.77,34.98 270 top
SW2  67.62,22.89 270 top
T1  19.75,31.23 180 top
TH  67.56,28.97 180 top
TP2  69.02,34.71 0 top
U2  54.84,23.84 90 top
U4  54.93,6.38 0 top
U5  62.69,6.67 270 top
U7  19.15,18.43 0 top
U11  31.7,27.64 90 top
U13  13.96,19.43 270 top

### Tracks (layer width: path | path; a pad name or v marks a point on that pad's centre or on a via)
3.3V
  Top 0.305: R13.2 32.94,25.47 33.59,26.12 33.59,28.39 | TP2.2 69.01,34.09 68.46,33.55 67.21,33.55 66.7,33.04 C11.1 66.86,32.4 TH.3
  Top 0.406: U11.6 33.59,28.39 33.8,28.39 | 29.08,5.47 R1.2 | SENSORCORRIENTE.1 31.71,8.87 29.63,6.79 | 19.14,8.15 19.45,7.83 19.5,7.79 | 18.75,7.76 18.79,7.79
  Top 0.508: U4.4 54.3,5.92 52.95,7.27 49.94,7.27 | U2.2 52.27,29 54.85,31.58 65.72,31.58 C11.1 | SENSORCORRIENTE.4 33.7,8.85 35.49,8.85 C6.1 37.05,9.16 | A0.1 23.12,11.74 A1.1 | 37.05,9.16 37.9,9.16 38.79,9.16 | 38.79,9.16 40.08,9.16 42.03,7.21 C8.1 | 37.05,9.16 37.9,10.01 37.94,10.01 38.79,9.16 | 29.63,6.79 R1.2
  Top 0.61: C7.1 49.94,7.27 50.49,7.82 U4.16 | U4.4 54.3,2.66 55.03,1.93 66.68,1.93 68.66,3.91 R10.2 | A1.1 23.07,13.12 23.74,13.79 37.22,13.79 | 37.2,13.77 37.9,13.77 | 37.9,14.47 37.22,13.79 | 37.22,13.79 37.2,13.77 | 37.2,13.77 37.8,13.17 37.9,13.17 | JP2.2 18.44,7.45 18.75,7.76 19.14,8.15 19.45,8.46 | A0.1 19.9,8.91 19.45,8.46 | 29.08,5.47 JP1.1 21.82,5.47 19.5,7.79 18.79,7.79 | 19.45,8.46 19.45,7.83
  Top 0.813: C15.1 34.65,29.24 33.8,28.39 | C1.1 | 45.87,28.93 U2.2 | R2.2 42.73,28.92 C2.1 42.51,29.15 38.81,29.15 | 38.81,29.15 37.9,29.15 | 37.9,29.15 37.03,29.15 | 37.03,29.15 35,29.15 | 37.9,29.15 37.9,28.28 | 37.9,28.28 37.9,14.47 37.9,13.77 37.9,13.17 37.9,10.01 37.9,9.16 | 37.03,29.15 37.9,28.28 | 38.81,29.15 37.94,28.28 37.9,28.28
  Top 1.016: C2.1 C1.1 | C1.1 45.87,28.93 | 35,29.15 C15.1 | C8.1 48.41,7.22 C7.1
ADDR0
  Top 0.203: A0.2 26.94,8.91 R9.2 26.98,9.62 27.51,10.15 31.88,10.15 32.38,10.64 SENSORCORRIENTE.7
ADDR1
  Top 0.203: SENSORCORRIENTE.8 30.88,10.62 27.57,10.62 26.98,11.21 R11.2 A1.2
CC1
  Top 0.203: J2.B5 8.34,28.65 8.68,28.31 8.68,26.8 9.04,26.44 R18.2
CC2  (via drill 0.25)
  Top 0.203: J2.A5 8.2,31.65 v8.47,31.92 | R19.2 v10.4,34.63 v10.41,34.64
  Bottom 0.203: v8.47,31.92 10.41,33.86 v10.41,34.64
CH_!CHRG
  Top 0.203: D8.3 2.63,24.47 R23.1
CH_!STDBY
  Top 0.203: D8.2 2.65,23.03 R22.1
CURRENT_MSR  (via drill 0.25)
  Top 0.406: SENSORCORRIENTE.2 32.38,5.75 33.2,4.92 R1.1 | R1.1 35.23,3.07 34.31,2.15 26.04,2.15 JP1.2 | R1.1 v37.78,4.92 | v61.55,10.75 v43.63,10.75
  Bottom 0.406: v37.78,4.92 43.61,10.75 v43.63,10.75 | v61.55,10.75 65.64,10.75 67.98,13.09 J3.1
ESP1_TX1/USB_RX  (via drill 0.25)
  Top 0.203: U4.3 52.96,3.65 52.96,5.93 v52.92,5.97 | v60.87,18.39 60.87,25.39 61.94,26.46 U2.35
  Bottom 0.203: v52.92,5.97 52.19,6.7 49.25,6.7 47.78,8.17 47.78,17.25 48.92,18.39 v60.87,18.39
ESP3_RX1/USB_TX  (via drill 0.25)
  Top 0.203: U4.2 v51.76,5.94 | v61.71,19.17 61.44,19.44 61.44,24.45 62.21,25.22 63.7,25.22 U2.34
  Bottom 0.203: v51.76,5.94 48.86,5.94 47.07,7.73 47.07,17.55 48.69,19.17 v61.71,19.17
ESP16_RX2/LORA_TX  (via drill 0.25)
  Top 0.203: U2.27 v61.55,16.3 v61.54,16.29
  Bottom 0.203: v61.54,16.29 74.88,16.29 77.05,14.12 77.05,6.84 75.67,5.46 J3.4
ESP17_TX2/LORA_RX  (via drill 0.25)
  Top 0.203: U2.28 65.07,17.57 65.63,17.01 v65.63,8.33
  Bottom 0.203: v65.63,8.33 72.53,8.33 J3.3
ESP32_!DTR
  Top 0.203: R6.1 61.77,8.65 U5.1 55.61,7.32 54.3,8.63 U4.13
ESP32_!RTS
  Top 0.203: U4.14 53.03,8.74 55.13,6.64 59.42,6.64 60.69,5.37 60.69,3.86 61.25,3.3 63,3.3 63.57,3.87 R5.1 63.57,5.97 U5.4
ESP32_EN  (via drill 0.25)
  Top 0.203: v49.49,27.77 49.43,27.71 | 49.43,27.61 49.44,27.59
  Top 0.305: C3.1 41.14,25.69 R2.1 43.66,25.69 44.56,26.59 44.56,27.38 44.92,27.74 U2.3 49.44,27.73 49.44,27.59 | U5.3 61.38,6.02 v60.79,6.61 | 49.43,27.71 49.43,27.61 v49.43,15.92 v49.44,15.92 | v42.77,31.93 SW1.2
  Bottom 0.305: v49.44,15.92 58.75,6.61 v60.79,6.61 | v49.49,27.77 49.49,30.25 47.81,31.93 v42.77,31.93
ESP_0/BOOT
  Top 0.203: U5.6 64.32,7.32 64.65,7.65 64.65,10.53 63.74,11.44 U2.25
ESP_13/AUX  (via drill 0.35)
  Top 0.2: U2.16 50.39,12.7 v53.05,15.36 | SW2.2 67.64,20.77 v67.64,18.57
  Bottom 0.2: v53.05,15.36 55,17.31 61.77,17.31 66.38,17.31 v67.64,18.57
ESP_14/LORA_RST  (via drill 0.25)
  Top 0.203: v48.59,17.02 48.59,15.6 48.01,15.03 U2.13
  Bottom 0.203: J3.2 72.17,9.85 56.96,9.85 49.79,17.02 v48.59,17.02
ESP_18/LORA_ST
  Top 0.2: 64.39,20.11 64.47,20.02 | 64.47,20.02 67.79,16.71 69.34,16.71 69.94,16.11 69.94,14.14 69.74,13.94 R12.2 | 64.47,20.02 63.82,20.02 U2.30
ESP_21/SDA  (via drill 0.25)
  Top 0.203: v18.41,20.48 v18.4,20.47 U7.8 | R4.1 v68.23,36.39 | TH.1 67.78,28.09 v67.78,27.46 67.78,27.44 64.26,23.92 U2.33 v62.23,23.92 | SENSORCORRIENTE.6 v33.02,12.66 v33.02,12.67
  Bottom 0.203: v68.23,36.39 68.25,36.37 68.25,27.93 v67.78,27.46 | v18.41,20.48 32.67,20.48 32.8,20.36 | 32.8,20.36 32.99,20.36 | 32.99,20.36 33.24,20.36 | 33.24,20.36 38.6,20.36 40.95,22.7 59.53,22.7 60.75,23.92 v62.23,23.92 | v33.02,12.67 33.02,20.14 | 33.02,20.14 33.02,20.32 32.99,20.36 | 32.8,20.36 33.02,20.14 | 33.24,20.36 33.02,20.14
ESP_22/SCL  (via drill 0.25)
  Top 0.203: v65.79,26.73 65.79,27.14 65.2,27.73 U2.36 v59.73,27.73 v59.72,27.72 | TH.2 v70.2,29.37 71.37,29.37 72.47,30.47 72.47,35.87 71.94,36.4 R3.1 | U7.7 18.9,19.97 19.17,20.24 v19.17,21.22 | SENSORCORRIENTE.5 33.67,12.35 v33.97,12.64 | v33.97,19.58 v33.97,20.98
  Bottom 0.203: v65.79,26.73 69.23,26.73 70.2,27.7 v70.2,29.37 | v59.72,27.72 59.72,23.61 59.32,23.21 40.56,23.21 38.33,20.98 v33.97,20.98 33.73,21.22 v19.17,21.22 | v33.97,12.64 v33.97,19.58
GND  (via drill 0.25)
  other vias: 52.4,23.83 54.23,23.82 52.39,22 54.23,22.02 52.46,25.7 50.57,25.69 50.53,23.84 50.53,21.99 50.53,20.15 52.4,20.19 54.22,20.14 56.05,20.15 56.13,22 56.12,23.86 56.12,25.64 54.24,25.74 11.5,30.1 10.67,30.1 76.58,35.83 77.58,35.83 78.58,35.83 77.58,34.83 76.58,34.83 78.58,34.83 78.58,33.83 77.58,33.83 76.58,33.83 79.58,35.83 79.58,34.83 79.58,33.83 80.58,33.83 80.58,34.83 80.58,35.83 79.58,32.83 78.58,32.83 77.58,32.83 76.58,32.83 76.58,31.83 77.58,31.83 78.58,31.83 79.58,31.83 80.58,31.83 80.58,32.83 22.74,26.07 23.74,26.07 24.74,26.07 23.74,25.07 22.74,25.07 24.74,25.07 24.74,24.07 23.74,24.07 22.74,24.07 25.74,26.07 25.74,25.07 25.74,24.07 25.74,23.07 24.74,23.07 23.74,23.07 22.74,23.07 1.14,16 2.14,16 3.14,16 2.14,15 1.14,15 3.14,15 3.14,14 2.14,14 1.14,14 4.14,16 4.14,15 4.14,14 4.14,13 3.14,13 2.14,13 1.14,13 35.97,36.61 36.97,36.61 37.97,36.61 36.97,35.61 35.97,35.61 37.97,35.61 37.97,34.61 36.97,34.61 35.97,34.61 38.97,36.61 38.97,35.61 38.97,34.61 38.97,33.61 37.97,33.61 36.97,33.61 35.97,33.61 12.5,37 13.5,37 14.5,37 13.5,36 12.5,36 14.5,36 14.5,35 13.5,35 12.5,35 15.5,37 15.5,36 15.5,35 15.5,34 14.5,34 13.5,34 12.5,34 31.97,36.61 32.97,36.61 33.97,36.61 32.97,35.61 31.97,35.61 33.97,35.61 33.97,34.61 32.97,34.61 31.97,34.61 34.97,36.61 34.97,35.61 34.97,34.61 34.97,33.61 33.97,33.61 32.97,33.61 31.97,33.61 13.78,12.12 14.78,12.12 15.78,12.12 14.78,11.12 13.78,11.12 15.78,11.12 15.78,10.12 14.78,10.12 13.78,10.12 16.78,12.12 16.78,11.12 16.78,10.12 16.78,9.12 15.78,9.12 14.78,9.12 13.78,9.12 39.45,15.69 40.45,15.69 41.45,15.69 40.45,14.69 39.45,14.69 41.45,14.69 41.45,13.69 40.45,13.69 39.45,13.69 42.45,15.69 42.45,14.69 42.45,13.69 42.45,12.69 41.45,12.69 40.45,12.69 39.45,12.69 1,32 2,32 3,32 2,31 1,31 3,31 3,30 2,30 1,30 4,32 4,31 4,30 4,29 3,29 2,29 1,29 13.78,5.49 14.78,5.49 15.78,5.49 14.78,4.49 13.78,4.49 15.78,4.49 15.78,3.49 14.78,3.49 13.78,3.49 16.78,5.49 16.78,4.49 16.78,3.49 16.78,2.49 15.78,2.49 14.78,2.49 13.78,2.49 40.19,5.88 41.19,5.88 42.19,5.88 41.19,4.88 40.19,4.88 42.19,4.88 42.19,3.88 41.19,3.88 40.19,3.88 43.19,5.88 43.19,4.88 43.19,3.88 43.19,2.88 42.19,2.88 41.19,2.88 40.19,2.88
  pour Top (isolate 0.254, rank 2, no thermals): -2.06,43.96 91.1,43.96 91.1,13.52 91.1,-3.82 14.12,-3.82 -2.06,-3.82
  pour Bottom (isolate 0.254, no thermals): -3.43,42.04 88.32,42.04 88.32,-0.54 -3.43,-0.54
N$1
  Top 0.203: J2.A7 9.28,30.15 9.44,30.3 | 9.44,30.3 9.64,30.51 | 9.64,30.51 9.82,30.7 | 9.82,30.7 10.1,30.97 12.04,30.97 D5.1 | J2.B7 9,31.15 9.43,30.72 9.44,30.71 | 9.44,30.71 9.64,30.51 | 9.44,30.71 9.44,30.3 | 9.44,30.71 9.46,30.7 9.82,30.7
N$3  (via drill 0.25)
  Top 0.203: U4.5 55.49,3.65 55.55,3.71 v55.55,4.54 | D5.4 13.68,29.17 v14.01,29.17 | v14.47,25.66 19.34,25.66 21.01,23.99 v21.01,18.62
  Bottom 0.203: v14.01,29.17 14.01,26.12 v14.47,25.66 | v21.01,18.62 21.01,6.3 26.05,1.26 43.94,1.26 47.21,4.54 v55.55,4.54
N$4  (via drill 0.25)
  Top 0.203: D5.6 v13.84,31.09 v13.84,31.1 | v15.17,26.33 19.61,26.33 21.77,24.17 v21.77,19.6 | v56.83,4.99 U4.6
  Bottom 0.203: v13.84,31.1 15.17,29.77 v15.17,26.33 | v21.77,19.6 21.79,19.59 21.79,6.55 26.55,1.78 43.64,1.78 46.84,4.99 v56.83,4.99
N$5
  Top 0.305: D1.A 68.64,10.34 R10.1
N$7
  Top 0.305: R12.1 67.47,15.64 D2.A
N$8
  pour Top (isolate 0.254, no thermals): 30.3,30.6 30.3,29.65 31.11,28.87 31.11,27.95 31.22,27.84 31.33,27.84 31.36,27.87 31.36,30.67 31.19,30.84 30.54,30.84
N$10
  pour Top (isolate 0.254, no thermals): 32.03,30.74 32.03,28.01 32.14,27.9 32.31,27.9 32.34,27.93 32.34,28.86 32.65,29.17 33.09,29.17 33.26,29.34 33.26,30.76 33.04,30.98 32.27,30.98
N$11  (via drill 0.25)
  Top 0.203: R22.2 7.32,23.03 v7.34,23.01 | v13.32,15.06 U13.6
  Bottom 0.203: v7.34,23.01 13.32,17.03 v13.32,15.06
N$12  (via drill 0.25)
  Top 0.203: U11.4 32.2,26.42 v31.58,25.8 | v31.6,22.64 R13.1 R14.2
  Bottom 0.203: v31.58,25.8 31.6,25.78 v31.6,22.64
N$13  (via drill 0.25)
  Top 0.203: U13.7 v14.59,15.03 | v7.38,24.49 6.15,24.49 R23.2
  Bottom 0.203: v14.59,15.03 14.59,17.28 v7.38,24.49
N$14
  Top 0.203: TP2.3 69.84,34.72 71.25,34.72 R3.2
N$15
  Top 0.203: TP2.1 68.17,34.67 66.82,34.67 R4.2
N$18
  Top 0.203: U11.5 32.7,26.13 31.51,24.94 R15.1
N$24
  Top 0.203: U5.5 63.14,6.67 62.85,6.96 62.85,8.03 R6.2
N$25
  Top 0.203: U5.2 62.41,6.67 62.73,6.35 62.73,5.27 R5.2
N$31
  Top 0.203: U13.2 14.59,24.24 R21.2
USB-C-D+
  Top 0.203: D5.3 12.29,29.41 9.53,29.41 9.29,29.65 J2.B6 6.77,29.65 6.57,29.85 6.57,30.43 6.79,30.65 J2.A6
VBAT  (via drill 0.25)
  Top 0.305: C17.1 18.9,16.18 U7.2 U7.3
  Top 0.61: J1.2 3.4,10.07 C18.1
  Top 0.813: C18.1 U13.5 12.05,14.76 12.98,13.83 v17.24,13.83 | v17.24,13.83 18.48,13.83 19.1,14.45 19.1,16.14 C17.1 | T1.1 19.54,32.43 17.61,32.43 v17.26,32.08 17.26,31.11 v17.24,31.09 | v17.24,13.83 v17.24,14.36 v17.25,14.37
  Bottom 0.813: v17.79,13.84 16.7,13.84 v16.68,13.82 v17.23,13.82 v17.24,13.83 17.26,13.85 v17.26,32.08 17.39,32.21 17.4,32.21 17.63,32.44 v18.31,32.44
VBUS
  Top 0.305: J2.VBUS2 6.95,27.95 5.85,29.05 | 5.85,31.78 6.92,32.85 J2.VBUS1
  Top 0.406: 5.85,29.05 5.85,31.78
  Top 0.508: J2.VBUS1 10.08,32.85 D7.A
VCC
  Top 0.61: T1.2 20.68,30.84
  Top 0.813: D3.C 20.68,29.49 T1.2
  Top 1.016: S1.2 23.75,33.9 20.68,30.84
VIN  (via drill 0.25)
  Top 0.203: D5.5 14.23,30.05 15.81,28.47 R7.2
  Top 0.508: C16.1 U13.4 v12.05,23.75 v12.06,23.76 | U13.8 v15.86,14.99
  Top 0.813: C16.1 10.39,22.01 D7.C 15.71,28.18 R7.2 17.53,28.28 D3.A 18.75,29.16 T1.3
  Bottom 0.508: v12.06,23.76 15.86,19.96 v15.86,14.99
  Bottom 0.61: JP2.1 7.88,11 10.56,13.68 15,13.68 15.01,13.67 15.86,14.52 v15.86,14.99
VIN_S
  Top 0.305: U11.10 U11.1 30.7,26.52 29.81,25.63 R15.2
  Top 0.406: U11.10 30.15,28.94 29.38,28.94
  Top 0.508: 29.38,28.94 C14.1
  Top 1.016: S1.1 25.71,35.8 25.71,33.66 28,31.37 C14.1

### Text on the board
tPlace: USB HOST | OFF | ON | I2C | RESET | Buck-Boost | TH | Claudia / Pacori / PFC 2024 / Ingeniería Electrónica | HOST ESP-WROOM-32E | LiPo Charger | LORA | 3V3 | ON | RST | VBAT+ | VIN | RX | 3.3V | CORRIENTE | GND | VIN+ | TX | VIN- | GND | USB-to-Serial
bPlace: OFF | ON | 3V3 | VBAT+ | VIN | RST | RX | 3.3V | GND | TX | GND